# EAGLE design BlueTooth Shield (EAGLE 5.10)
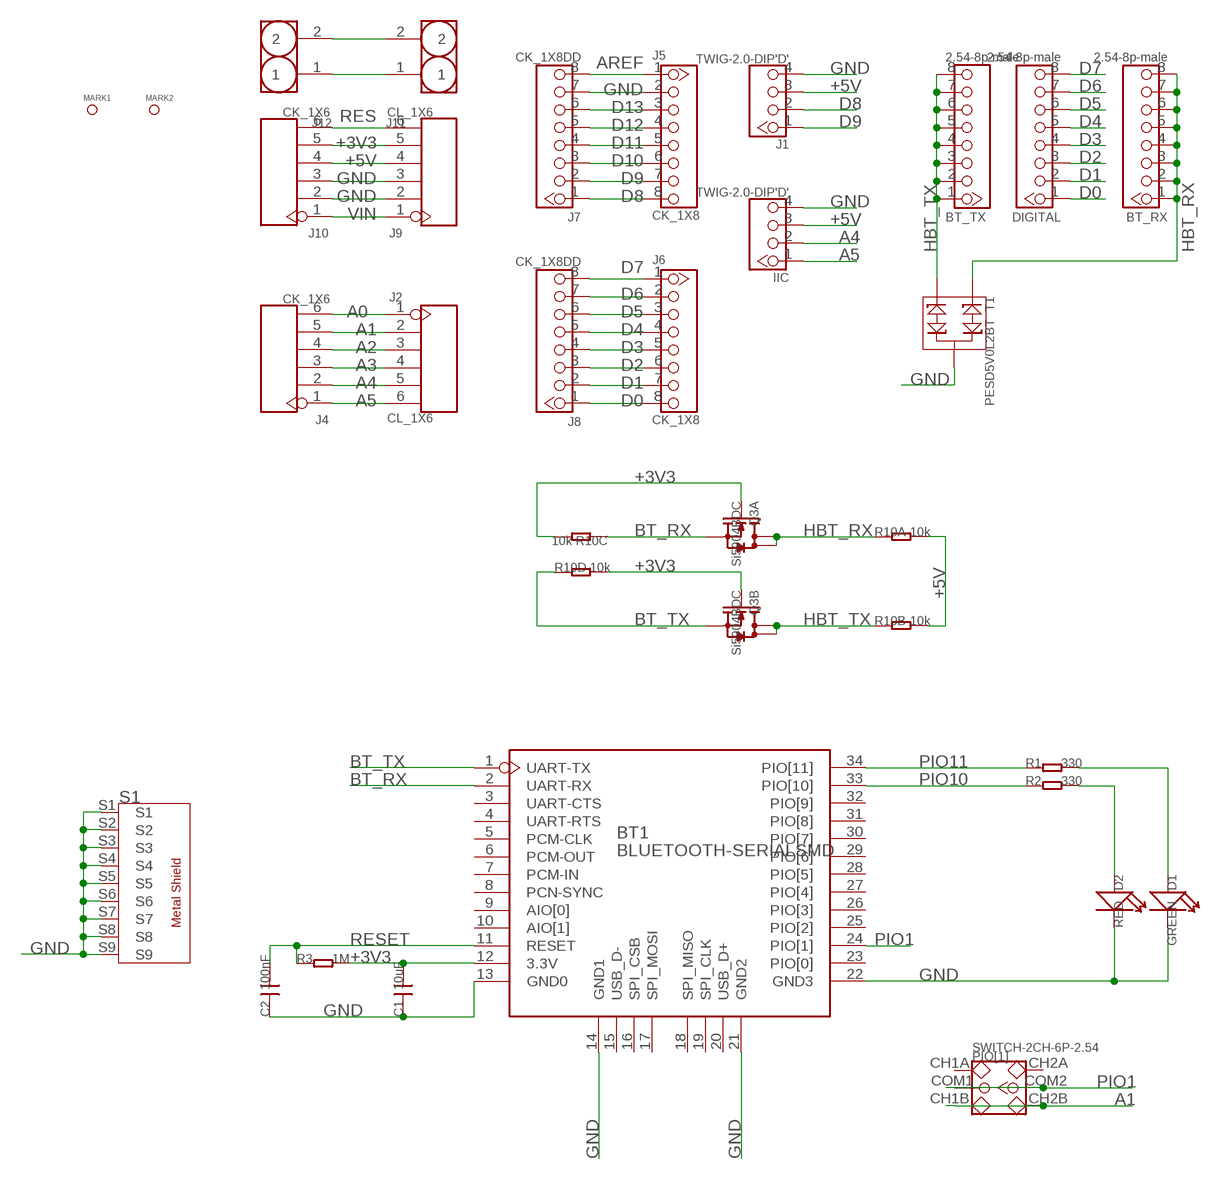
[diagram p0: schematic, sheet 1]

## Parts
BT1  BLUETOOTH-SERIALSMD  [SERIAL_BLUETEETH]
BT_RX  2.54-8p-male  HEADER-8P2.54  [CK_1X8]
BT_TX  2.54-8p-male  HEADER-8P2.54  [CK_1X8]
C1  10uF  C-0805  [0805]
C2  100nF  C-0603  [0603]
D1  GREEN  LED'0603'  [LED-0603]
D2  RED  LED'0603'  [LED-0603]
DIGITAL  2.54-8p-male  HEADER-8P2.54  [CK_1X8]
IIC  TWIG-2.0-DIP'D'  [2.0_1X4_90]
J1  TWIG-2.0-DIP'D'  [2.0_1X4_90]
J2  CL_1X6  CK_1X6  [CK_1X6]
J4  CK_1X6  [CK_1X6]
J5  CK_1X8  CK_1X8DD  [CK_1X8]
J6  CK_1X8  CK_1X8DD  [CK_1X8]
J7  CK_1X8DD  [CK_1X8]
J8  CK_1X8DD  [CK_1X8]
J9  CL_1X6  CK_1X6  [CK_1X6]
J10  CK_1X6  [CK_1X6]
J11  HEADER-2P2.54  [65*35]
J12  HEADER-2P2.54  [65*35]
MARK1  PAD-MARK  [MARK]
MARK2  PAD-MARK  [MARK]
PIO[1]  SWITCH-2CH-6P-2.54  SWITCH-2CH-6P-SMD  [6P-SMD-2CH-2.54-3.5X6.2]
Q3  Si5904BDC  010-DUAL-N-MOSFET_1206-8  [1206-8]
R1  330  R-0603  [0603]
R2  330  R-0603  [0603]
R3  1M  R-0603  [0603]
R10  10k  005-4R_1206  [R1206-8]
S1  EMI_SHIELD_BT  [BT_SHIELD]
T1  PESD5V0L2BT  D-ESD-PESDXL2BT  [SOT23]

## Nets
+3V3: BT1.12(3.3V) C1.2 J9.5 J10.5 Q3.2(A:G) Q3.4(B:G) R3.2 R10.5 R10.6
+5V: IIC.3 J1.3 J9.4 J10.4 R10.7 R10.8
A0: J2.1 J4.6
A1: J2.2 J4.5 PIO[1].CH1B PIO[1].CH2B
A2: J2.3 J4.4
A3: J2.4 J4.3
A4: IIC.2 J2.5 J4.2
A5: IIC.1 J2.6 J4.1
AREF: J5.1 J7.8
BT_RX: BT1.2(UART-RX) Q3.1(A:S) R10.3
BT_TX: BT1.1(UART-TX) Q3.3(B:S) R10.4
D0: DIGITAL.1 J6.8 J8.1
D1: DIGITAL.2 J6.7 J8.2
D2: DIGITAL.3 J6.6 J8.3
D3: DIGITAL.4 J6.5 J8.4
D4: DIGITAL.5 J6.4 J8.5
D5: DIGITAL.6 J6.3 J8.6
D6: DIGITAL.7 J6.2 J8.7
D7: DIGITAL.8 J6.1 J8.8
D8: J1.2 J5.8 J7.1
D9: J1.1 J5.7 J7.2
D10: J5.6 J7.3
D11: J5.5 J7.4
D12: J5.4 J7.5
D13: J5.3 J7.6
GND: BT1.13(GND0) BT1.14(GND1) BT1.21(GND2) BT1.22(GND3) C1.1 C2.1 D1.- D2.- IIC.4 J1.4 J5.2 J7.7 J9.2 J9.3 J10.2 J10.3 S1.S1 S1.S2 S1.S3 S1.S4 S1.S5 S1.S6 S1.S7 S1.S8 S1.S9 T1.3
HBT_RX: BT_RX.1 BT_RX.2 BT_RX.3 BT_RX.4 BT_RX.5 BT_RX.6 BT_RX.7 BT_RX.8 Q3.7(A:D) Q3.8(A:D) R10.1 T1.1
HBT_TX: BT_TX.1 BT_TX.2 BT_TX.3 BT_TX.4 BT_TX.5 BT_TX.6 BT_TX.7 BT_TX.8 Q3.5(B:D) Q3.6(B:D) R10.2 T1.2
N$2: D2.+ R2.2
N$4: J11.1 J12.1
N$5: D1.+ R1.2
N$6: J11.2 J12.2
PIO1: BT1.24(PIO[1]) PIO[1].COM1 PIO[1].COM2
PIO10: BT1.33(PIO[10]) R2.1
PIO11: BT1.34(PIO[11]) R1.1
RES: J9.6 J10.6
RESET: BT1.11(RESET) C2.2 R3.1
VIN: J9.1 J10.1
Unconnected: BT1.3(UART-CTS) BT1.4(UART-RTS) BT1.5(PCM-CLK) BT1.6(PCM-OUT) BT1.7(PCM-IN) BT1.8(PCN-SYNC) BT1.9(AIO[0]) BT1.10(AIO[1]) BT1.15(USB_D-) BT1.16(SPI_CSB) BT1.17(SPI_MOSI) BT1.18(SPI_MISO) BT1.19(SPI_CLK) BT1.20(USB_D+) BT1.23(PIO[0]) BT1.25(PIO[2]) BT1.26(PIO[3]) BT1.27(PIO[4]) BT1.28(PIO[5]) BT1.29(PIO[6]) BT1.30(PIO[7]) BT1.31(PIO[8]) BT1.32(PIO[9]) PIO[1].CH1A PIO[1].CH2A

## Library data of the parts
BT1 = Module:BLUETOOTH-SERIAL
BT_RX BT_TX DIGITAL = Connector:HEADER-8P
C1 C2 = Discrete:C*: Ceramic Capacitors
D1 D2 = Discrete:LED*
IIC J1 = Connector:TWIG-2.0-DIP
J2 J4 J9 J10 = CONNECTER:CK_1X6
J5-J8 = CONNECTER:CK_1X8
J11 J12 = Connector:HEADER-2P
MARK1 MARK2 = Discrete:PAD-MARK
PIO[1] = Discrete:SWITCH-2CH-6P
Q3 = Discrete:010-DUAL-N-MOSFET*: Si5902BDC Si5904DC Si5908DC Si5920DC
R1-R3 = Discrete:R*
R10 = Discrete:005-4R*: Resistor Array
S1 = Module:EMI_SHIELD
T1 = Discrete:D-ESD-PESDXL2BT

## Net classes
0 default: width 0.003 mm, drill 0.254 mm, clearance 0.152 mm

## Board
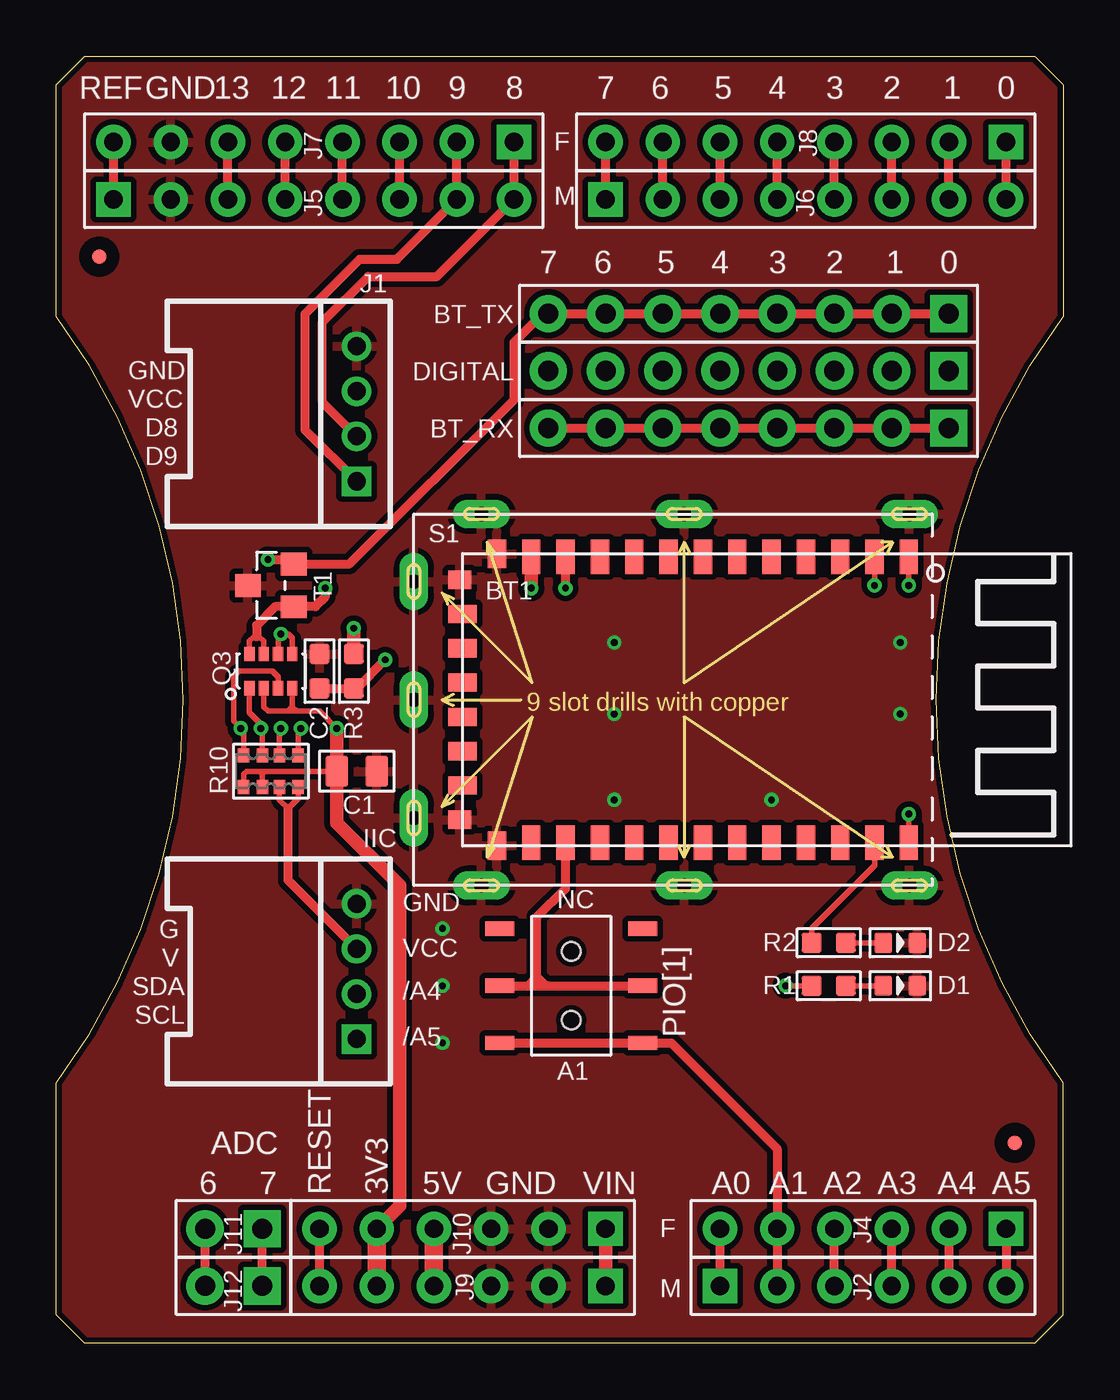
[diagram p1: board, top side]
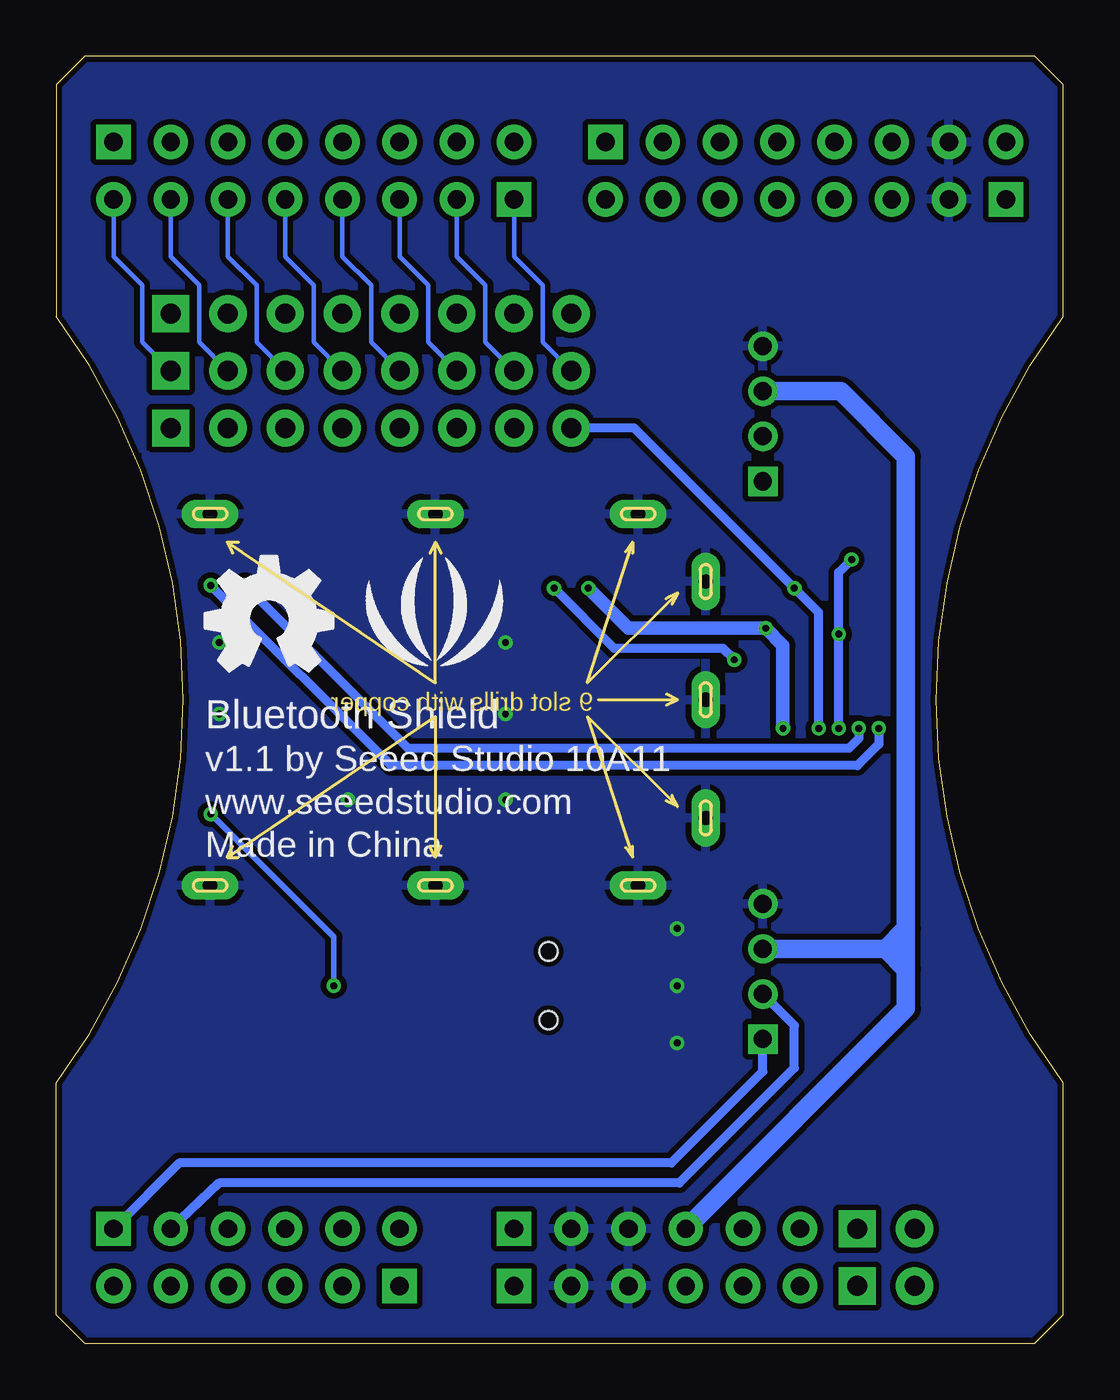
[diagram p2: board, bottom side, seen from below]

Size 44.7 x 57.15 mm. Coordinates in mm from the lower left corner, seen from the top.
Outline: 43.43,0 1.27,0 0,1.27 0,11.56 arc73 0,45.59 0,55.88 1.27,57.15 43.43,57.15 44.7,55.88 44.7,45.59 arc73 44.7,11.56 44.7,1.27 43.43,0
Copper layers (1*16): Top 0.035mm / dielectric 1.5mm / Bottom 0.035mm
Design rules "SeeedStudio_rule_no_angle_090911": minimum track width 6mil, minimum drill 12mil, track to track 6mil, track to pad 6mil, pad to pad 6mil, via to via 6mil, smd to smd 0mil, copper to edge 10mil, drill to drill 10mil, minimum pad ring 10mil, minimum via ring 6mil, stop-mask expansion 2mil, vias tented up to drill 100mil, thermal gap 10mil

### Footprints (pad centres in the part's own frame; a part is rotated, then mirrored left to right if it is on the bottom)
SERIAL_BLUETEETH = smd 1.524 x 0.813: 1 -6.35,19.812; 2 -6.35,18.288; 3 -6.35,16.764; 4 -6.35,15.24; 5 -6.35,13.716; 6 -6.35,12.192; 7 -6.35,10.668; 8 -6.35,9.144; 9 -6.35,7.62; 10 -6.35,6.096; 11 -6.35,4.572; 12 -6.35,3.048; 23 6.35,3.048; 24 6.35,4.572; 25 6.35,6.096; 26 6.35,7.62; 27 6.35,9.144; 28 6.35,10.668; 29 6.35,12.192; 30 6.35,13.716; 31 6.35,15.24; 32 6.35,16.764; 33 6.35,18.288; 34 6.35,19.812 | smd 1.27 x 0.813: 13 -6.477,1.524; 22 6.477,1.524 | smd 0.813 x 1.016: 14 -5.334,-0.127; 21 5.334,-0.127 | smd 0.813 x 1.27: 15 -3.81,0; 16 -2.286,0; 17 -0.762,0; 18 0.762,0; 19 2.286,0; 20 3.81,0
CK_1X8 = drill 0.889 pad 1.651 square: 1 0,8.89 | drill 0.889 pad 1.651 round: 2 0,6.35; 3 0,3.81; 4 0,1.27; 5 0,-1.27; 6 0,-3.81; 7 0,-6.35; 8 0,-8.89
0805 = smd 1.016 x 1.397: 1 -0.889,0; 2 0.889,0
0603 = smd 0.889 x 0.889: 1 -0.762,0; 2 0.762,0
LED-0603 = smd 0.762 x 0.889: + -0.762,0; - 0.762,0
2.0_1X4_90 = drill 0.8 pad 1.27 square: 1 -3,0 | drill 0.8 pad 1.27 round: 2 -1,0; 3 1,0; 4 3,0
CK_1X6 = drill 0.813 pad 1.524 square: 1 0,6.35 | drill 0.813 pad 1.524 round: 2 0,3.81; 3 0,1.27; 4 0,-1.27; 5 0,-3.81; 6 0,-6.35
CK_1X8' = drill 0.813 pad 1.524 square: 1 0,8.89 | drill 0.813 pad 1.524 round: 2 0,6.35; 3 0,3.81; 4 0,1.27; 5 0,-1.27; 6 0,-3.81; 7 0,-6.35; 8 0,-8.89
65*35 = drill 0.889 pad 1.651 square: 1 0,1.27 | drill 0.889 pad 1.651 round: 2 0,-1.27
MARK = smd 0.635 x 0.635: P$1 0,0
6P-SMD-2CH-2.54-3.5X6.2 = smd 1.27 x 0.635: CH1A -3.175,2.54; CH1B -3.175,-2.54; CH2A 3.175,2.54; CH2B 3.175,-2.54; COM1 -3.175,0; COM2 3.175,0 | hole 0.813: 0,1.524; 0,-1.524
1206-8 = smd 0.457 x 0.635: 1 -0.953,-0.762; 2 -0.318,-0.762; 3 0.318,-0.762; 4 0.953,-0.762; 5 0.953,0.762; 6 0.318,0.762; 7 -0.318,0.762; 8 -0.953,0.762
R1206-8 = smd 0.508 x 0.635: 1 -1.206,-0.699; 2 -0.381,-0.699; 3 0.381,-0.699; 4 1.206,-0.699; 5 1.206,0.699; 6 0.381,0.699; 7 -0.381,0.699; 8 -1.206,0.699
BT_SHIELD = drill 0.635 pad 1.27 long: S1 0,5.25; S2 0,0; S3 0,-5.25; S4 3,-8.25; S5 12,-8.25; S6 22,-8.25; S7 22,8.25; S8 12,8.25; S9 3,8.25
SOT23 = smd 1.016 x 1.143: 1 -0.95,-1.016; 2 0.95,-1.016; 3 0,1.016

### Placement (x,y rotation side)
BT1  18.03,28.57 270 top
BT_RX  30.73,40.64 270 top
BT_TX  30.73,45.72 270 top
C1  13.34,25.4 180 top
C2  11.68,29.84 270 top
D1  37.47,15.88 0 top
D2  37.47,17.78 0 top
DIGITAL  30.73,43.18 270 top
IIC  13.34,16.51 90 top
J1  13.34,41.27 90 top
J2  35.81,2.54 90 top
J4  35.81,5.08 270 top
J5  CK_1X8  [CK_1X8']  11.43,50.8 90 top
J6  CK_1X8  [CK_1X8']  33.27,50.8 90 top
J7  CK_1X8DD  [CK_1X8']  11.43,53.34 270 top
J8  CK_1X8DD  [CK_1X8']  33.27,53.34 270 top
J9  18.03,2.54 270 top
J10  18.03,5.08 270 top
J11  7.87,5.08 270 top
J12  7.87,2.54 270 top
MARK1  42.55,8.89 0 top
MARK2  1.91,48.26 0 top
PIO[1]  22.86,15.88 0 top
Q3  9.53,29.84 0 top
R1  34.29,15.88 0 top
R2  34.29,17.78 0 top
R3  13.21,29.84 90 top
R10  9.53,25.4 180 top
S1  15.88,28.57 0 top
T1  9.53,33.66 90 top
U$1  [OSHW_FILLX200_NOTEXT]  38.1,29.84 0 bottom
U$2  [LOGO_SILK]  27.94,31.75 0 bottom

### Tracks (layer width: path | path; a pad name or v marks a point on that pad's centre or on a via)
+3V3  (via drill 0.3 pad 0.64)
  Top 0.254: C1.2 9.27,25.4 | 9.27,25.4 9.14,25.27 | 9.14,25.27 R10.6 | 9.27,25.4 9.02,25.4 | 9.14,25.27 9.02,25.4 | 9.02,25.4 8.45,25.4 8.32,25.27 R10.5 | Q3.2 9.21,28.26 9.4,28.07 10.29,28.07 | 10.67,28.07 10.29,28.07 | 10.48,28.26 Q3.4 | 10.29,28.07 10.48,28.26 | 10.67,28.07 10.48,28.26 | 10.67,28.07 11.68,28.07 v12.45,27.3
  Top 0.61: J10.5 15.24,6.1 15.24,20.32 12.45,23.11 C1.2 v12.45,27.3 | v21.08,33.53 BT1.12 | v13.21,31.75 R3.2
  Top 0.813: J9.5 J10.5
  Bottom 0.61: v21.08,33.53 19.3,31.75 v13.21,31.75 12.45,30.99 v12.45,27.3
+5V
  Top 0.254: R10.7 9.91,24.13 10.29,23.75 10.73,24.19 R10.8
  Top 0.406: IIC.3 10.29,20.56 10.29,23.75
  Top 0.813: J9.4 J10.4
  Bottom 0.813: J10.4 6.99,14.86 6.99,16.61 | 6.99,16.61 6.99,18.41 | 6.99,18.41 6.99,39.37 9.89,42.27 J1.3 | 6.99,18.41 7.89,17.51 | 6.99,16.61 7.89,17.51 | 7.89,17.51 IIC.3
A0
  Top 0.406: J2.1 J4.6
A1
  Top 0.406: J2.2 J4.5 32,8.64 27.3,13.34 PIO[1].CH2B PIO[1].CH1B
A2
  Top 0.406: J2.3 J4.4
A3
  Top 0.406: J2.4 J4.3
A4
  Top 0.406: J4.2 J2.5
  Bottom 0.406: J4.2 37.47,7.11 17.05,7.11 11.94,12.22 11.94,14.11 IIC.2
A5
  Top 0.406: J4.1 J2.6
  Bottom 0.406: IIC.1 13.34,12.06 17.4,8 39.24,8 J4.1
AREF
  Top 0.406: J5.1 J7.8
BT_RX  (via drill 0.3 pad 0.64)
  Top 0.254: Q3.1 8.57,28 9.08,27.5 v9.08,27.3 9.14,27.24 R10.3 | v36.32,33.66 BT1.2
  Bottom 0.406: v36.32,33.66 29.08,26.42 9.53,26.42 9.08,26.86 v9.08,27.3
BT_TX  (via drill 0.3 pad 0.64)
  Top 0.254: Q3.3 9.84,29.59 9.59,29.84 8.13,29.84 7.87,29.59 7.87,27.62 v8.19,27.3 8.32,27.18 R10.4 | v37.85,33.66 BT1.1
  Bottom 0.406: v37.85,33.66 29.84,25.65 9.14,25.65 8.19,26.61 v8.19,27.3
D0
  Top 0.406: J6.8 J8.1
  Bottom 0.203: DIGITAL.1 40.89,44.45 40.89,46.99 42.16,48.26 J6.8
D1
  Top 0.406: J6.7 J8.2
  Bottom 0.203: DIGITAL.2 38.35,44.45 38.35,46.99 39.62,48.26 J6.7
D2
  Top 0.406: J6.6 J8.3
  Bottom 0.203: DIGITAL.3 35.81,44.45 35.81,46.99 37.08,48.26 J6.6
D3
  Top 0.406: J6.5 J8.4
  Bottom 0.203: DIGITAL.4 33.27,44.45 33.27,46.99 34.54,48.26 J6.5
D4
  Top 0.406: J6.4 J8.5
  Bottom 0.203: DIGITAL.5 30.73,44.45 30.73,46.99 32,48.26 J6.4
D5
  Top 0.406: J6.3 J8.6
  Bottom 0.203: DIGITAL.6 28.19,44.45 28.19,46.99 29.46,48.26 J6.3
D6
  Top 0.406: J6.2 J8.7
  Bottom 0.203: DIGITAL.7 25.65,44.45 25.65,46.99 26.92,48.26 J6.2
D7
  Top 0.406: J6.1 J8.8
  Bottom 0.203: DIGITAL.8 23.11,44.45 23.11,46.99 24.38,48.26 J6.1
D8
  Top 0.406: J1.2 13.32,40.27 11.81,41.78 11.81,45.34 13.84,47.37 16.89,47.37 J5.8 J7.1
D9
  Top 0.406: J1.1 11.05,40.56 11.05,45.72 13.46,48.13 15.11,48.13 J5.7 J7.2
D10
  Top 0.406: J5.6 J7.3
D11
  Top 0.406: J5.5 J7.4
D12
  Top 0.406: J5.4 J7.5
D13
  Top 0.406: J5.3 J7.6
GND  (via drill 0.3 pad 0.64)
  other vias: 24.77,31.11 24.77,24.13 24.77,27.94 37.47,31.11 37.47,27.94 31.75,24.13 17.14,13.34 17.14,15.88 17.14,18.41
  pour Bottom (isolate 0.254, rank 6): 0,57.15 45.09,57.15 45.09,0 0,0
  pour Top (isolate 0.254, rank 6): 0,57.15 45.09,57.15 45.09,0 0,0
HBT_RX  (via drill 0.3 pad 0.64)
  Top 0.254: R10.1 10.73,27.18 v10.86,27.3 | Q3.7 9.21,31.18 9.02,31.37 8.89,31.37 8.76,31.37 8.57,31.18 Q3.8
  Top 0.406: BT_RX.8 BT_RX.7 BT_RX.6 BT_RX.5 BT_RX.4 BT_RX.3 BT_RX.2 BT_RX.1 | 8.89,31.37 8.89,31.88 9.72,32.7 T1.1 11.5,32.7 11.94,33.15 v11.94,33.53
  Bottom 0.406: BT_RX.8 19.05,40.64 v11.94,33.53 10.86,32.45 v10.86,27.3
HBT_TX  (via drill 0.3 pad 0.64)
  Top 0.254: R10.2 9.91,27.24 v9.97,27.3 | Q3.6 9.84,31.37 v9.97,31.5 10.29,31.5 10.48,31.3 Q3.5
  Top 0.406: BT_TX.1 BT_TX.2 BT_TX.3 BT_TX.4 BT_TX.5 BT_TX.6 BT_TX.7 BT_TX.8 21.59,45.72 20.32,44.45 20.32,41.91 13.02,34.6 T1.2 10.35,34.8 v9.4,34.8
  Bottom 0.406: v9.97,27.3 v9.97,31.5 9.97,34.23 v9.4,34.8
N$2
  Top 0.254: R2.2 D2.+
N$4
  Top 0.406: J12.1 J11.1
N$5
  Top 0.254: R1.2 D1.+
N$6
  Top 0.406: J12.2 J11.2
PIO1
  Top 0.406: BT1.24 22.61,20.19 21.34,18.92 21.34,16.26 | 20.95,15.88 21.34,16.26 | PIO[1].COM1 20.95,15.88 | 20.95,15.88 21.84,15.88 | PIO[1].COM2 21.72,15.88 21.34,16.26
PIO10
  Top 0.254: BT1.33 36.32,21.21 33.53,18.41 R2.1
PIO11  (via drill 0.3 pad 0.64)
  Top 0.254: v37.85,23.5 BT1.34 | v32.38,15.88 R1.1
  Bottom 0.254: v37.85,23.5 32.38,18.03 v32.38,15.88
RES
  Top 0.406: J9.6 J10.6
RESET  (via drill 0.3 pad 0.64)
  Top 0.406: C2.2 R3.1 13.34,29.08 v14.61,30.35 | v22.61,33.53 BT1.11
  Bottom 0.406: v14.61,30.35 15.11,30.86 19.94,30.86 v22.61,33.53
VIN
  Top 0.61: J9.1 J10.1

### Text on the board
tPlace: REF | GND | 13 | 12 | 11 | 10 | 9 | 8 | 7 | 6 | 5 | 4 | 3 | 2 | 1 | 0 | J7 | F | J8 | M | J5 | J6 | 7 | 6 | 5 | 4 | 3 | 2 | 1 | 0 | GND | VCC | D8 | D9 | G | GND | NC | V | VCC | SDA | SCL | /A4 | /A5 | A1 | ADC | 6 | 7 | RESET | 3V3 | 5V | GND | VIN | A0 | A1 | A2 | A3 | A4 | A5 | F | J4 | M | J2
bPlace: Bluetooth Shield | v1.1 by Seeed Studio 10A11 | www.seeedstudio.com | Made in China